# Altium schematic sheet Multi-sheet.SchDoc
size A; SheetNumber: 1; SheetTotal: 9
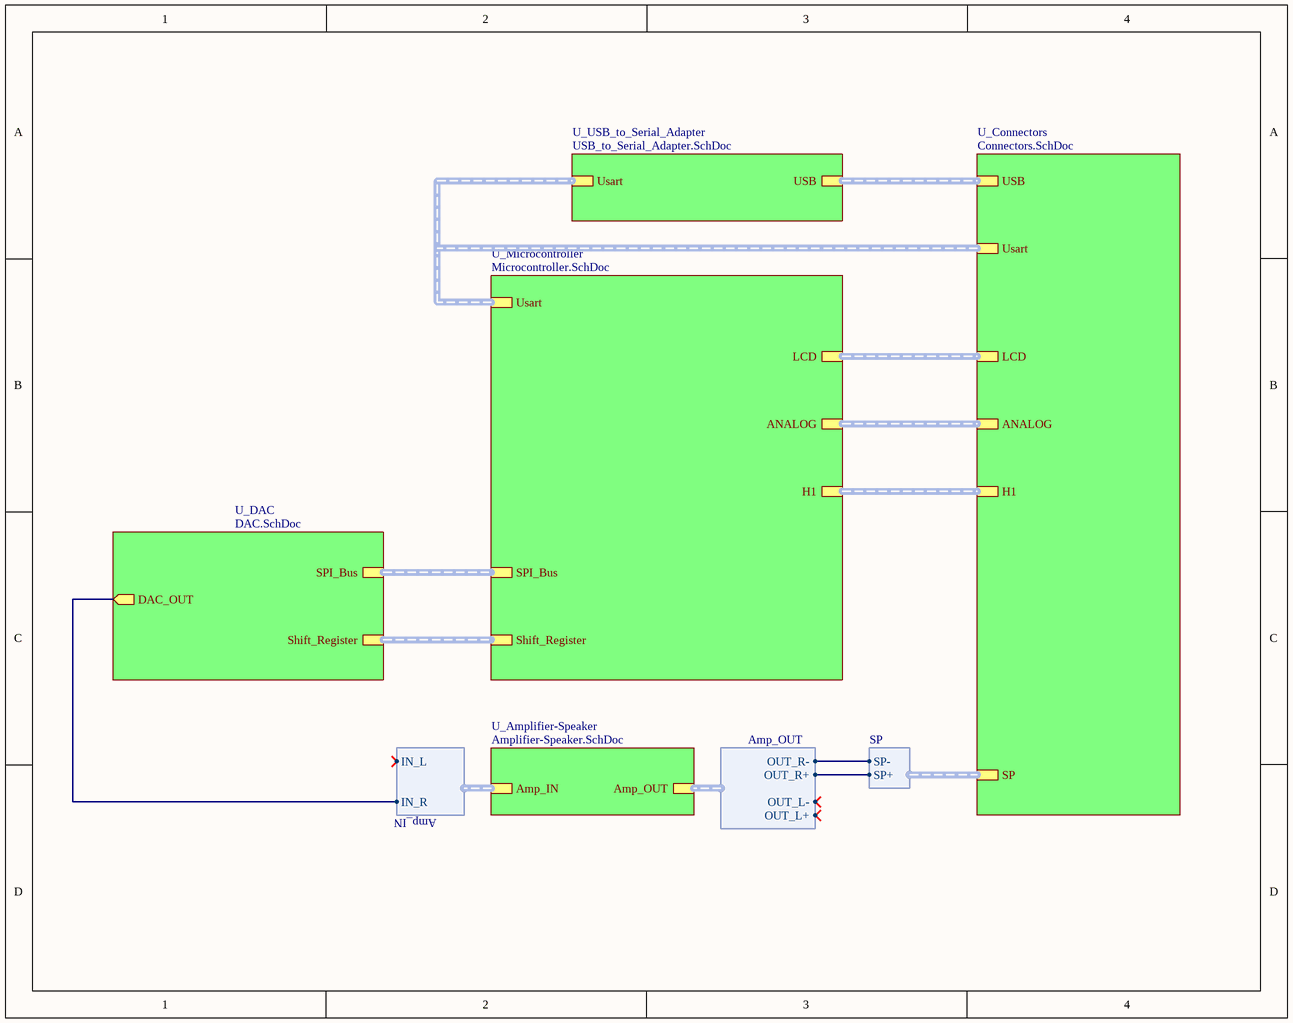
[diagram p0: Multi-sheet.SchDoc]

## Sub-sheets
U_Amplifier-Speaker = Amplifier-Speaker.SchDoc: Amp_IN (harness Amp_IN), Amp_OUT (harness Amp_OUT)
U_Connectors = Connectors.SchDoc: USB (harness USB), LCD (harness LCD), SP (harness SP), ANALOG (harness ANALOG), H1 (harness H1), Usart (harness Usart)
U_DAC = DAC.SchDoc: SPI_Bus (harness SPI_Bus), DAC_OUT (out), Shift_Register (harness SHIFT_REGISTER)
U_Microcontroller = Microcontroller.SchDoc: SPI_Bus (harness SPI_Bus), Usart (harness Usart), Shift_Register (harness Shift_Register), LCD (harness LCD), H1 (harness h1), ANALOG (harness ANALOG)
U_USB_to_Serial_Adapter = USB_to_Serial_Adapter.SchDoc: USB (harness USB), Usart (harness Usart)

## Harnesses
Amp_IN: IN_L, IN_R
Amp_OUT: OUT_L+, OUT_L-, OUT_R+, OUT_R-
SP: SP+, SP-

## Nets
(unnamed): sheet U_DAC/DAC_OUT, sheet U_Amplifier-Speaker/Amp_IN.IN_R
(unnamed): sheet U_Amplifier-Speaker/Amp_OUT.OUT_R+, sheet U_Connectors/SP.SP+
(unnamed): sheet U_Amplifier-Speaker/Amp_OUT.OUT_R-, sheet U_Connectors/SP.SP-

## Buses and harness runs
harness sheet U_Connectors/ANALOG = sheet U_Microcontroller/ANALOG
harness sheet U_Connectors/H1 = sheet U_Microcontroller/H1
harness sheet U_Connectors/LCD = sheet U_Microcontroller/LCD
harness sheet U_Connectors/Usart = sheet U_Microcontroller/Usart = sheet U_USB_to_Serial_Adapter/Usart
harness sheet U_Connectors/USB = sheet U_USB_to_Serial_Adapter/USB
harness sheet U_DAC/Shift_Register = sheet U_Microcontroller/Shift_Register
harness sheet U_DAC/SPI_Bus = sheet U_Microcontroller/SPI_Bus